# Altium schematic sheet Digital_DSP.SchDoc
size 508 x 241 mm
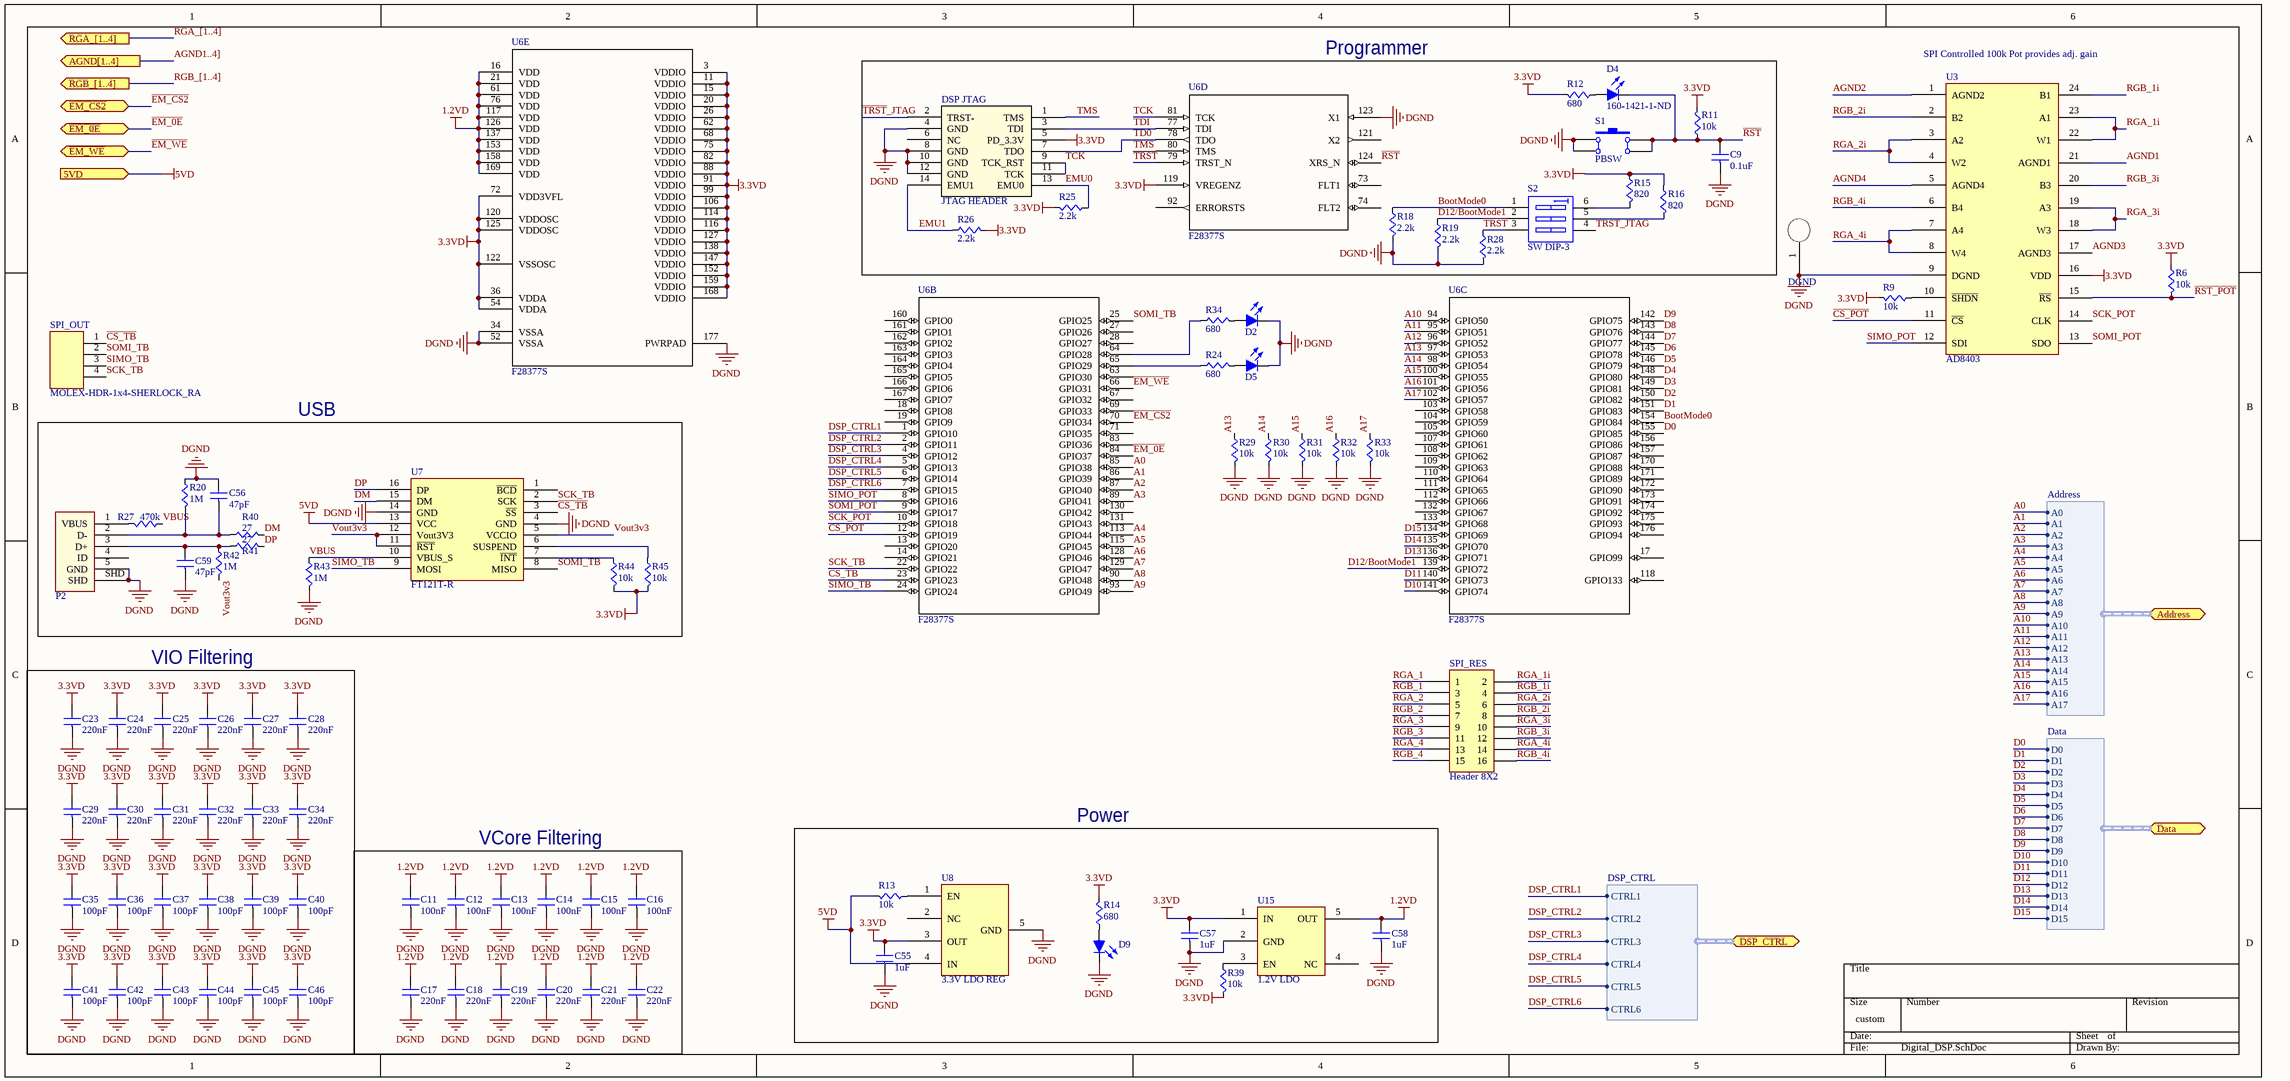
[diagram p0: Digital_DSP.SchDoc]

## Parts
C9  value 0.1uF  [CAPC0603]  (hidden comment: Cap)
C11  value 100nF  [CAPC0603]  (hidden comment: Cap)
C12  value 100nF  [CAPC0603]  (hidden comment: Cap)
C13  value 100nF  [CAPC0603]  (hidden comment: Cap)
C14  value 100nF  [CAPC0603]  (hidden comment: Cap)
C15  value 100nF  [CAPC0603]  (hidden comment: Cap)
C16  value 100nF  [CAPC0603]  (hidden comment: Cap)
C17  value 220nF  [CAPC0603]  (hidden comment: Cap)
C18  value 220nF  [CAPC0603]  (hidden comment: Cap)
C19  value 220nF  [CAPC0603]  (hidden comment: Cap)
C20  value 220nF  [CAPC0603]  (hidden comment: Cap)
C21  value 220nF  [CAPC0603]  (hidden comment: Cap)
C22  value 220nF  [CAPC0603]  (hidden comment: Cap)
C23  value 220nF  [CAPC0603]  (hidden comment: Cap)
C24  value 220nF  [CAPC0603]  (hidden comment: Cap)
C25  value 220nF  [CAPC0603]  (hidden comment: Cap)
C26  value 220nF  [CAPC0603]  (hidden comment: Cap)
C27  value 220nF  [CAPC0603]  (hidden comment: Cap)
C28  value 220nF  [CAPC0603]  (hidden comment: Cap)
C29  value 220nF  [CAPC0603]  (hidden comment: Cap)
C30  value 220nF  [CAPC0603]  (hidden comment: Cap)
C31  value 220nF  [CAPC0603]  (hidden comment: Cap)
C32  value 220nF  [CAPC0603]  (hidden comment: Cap)
C33  value 220nF  [CAPC0603]  (hidden comment: Cap)
C34  value 220nF  [CAPC0603]  (hidden comment: Cap)
C35  value 100pF  [CAPC0603]  (hidden comment: Cap)
C36  value 100pF  [CAPC0603]  (hidden comment: Cap)
C37  value 100pF  [CAPC0603]  (hidden comment: Cap)
C38  value 100pF  [CAPC0603]  (hidden comment: Cap)
C39  value 100pF  [CAPC0603]  (hidden comment: Cap)
C40  value 100pF  [CAPC0603]  (hidden comment: Cap)
C41  value 100pF  [CAPC0603]  (hidden comment: Cap)
C42  value 100pF  [CAPC0603]  (hidden comment: Cap)
C43  value 100pF  [CAPC0603]  (hidden comment: Cap)
C44  value 100pF  [CAPC0603]  (hidden comment: Cap)
C45  value 100pF  [CAPC0603]  (hidden comment: Cap)
C46  value 100pF  [CAPC0603]  (hidden comment: Cap)
C55  value 1uF  [CAPC0603]  (hidden comment: Cap1206)
C56  value 47pF  [CAPC0603]  (hidden comment: Cap1206)
C57  value 1uF  [CAPC0603]  (hidden comment: Cap1206)
C58  value 1uF  [CAPC0603]  (hidden comment: Cap1206)
C59  value 47pF  [CAPC0603]  (hidden comment: Cap1206)
D2  LED-RED  [LED0805-RED]  (value not drawn)
D4  Supplier Part Number: 160-1421-1-ND  [LED0805-RED]  (hidden comment: LED-RED)
D5  LED-RED  [LED0805-RED]  (value not drawn)
D9  LED-RED  [LED0805-RED]  (value not drawn)
DGND  Test_Point  [TP]  (value not drawn)
DSP_JTAG  JTAG HEADER  [JTAG HEADER - 14]
P2  USB Micro  [10118192-0001LF]  (value not drawn)
R6  value 10k  [RES0603]  (hidden comment: Res)
R9  value 10k  [RES0603]  (hidden comment: Res)
R11  value 10k  [RES0603]  (hidden comment: Res)
R12  value 680  [RES0603]  (hidden comment: Res)
R13  value 10k  [RES0603]  (hidden comment: Res)
R14  value 680  [RES0603]  (hidden comment: Res)
R15  value 820  [RES0603]  (hidden comment: Res)
R16  value 820  [RES0603]  (hidden comment: Res)
R18  value 2.2k  [RES0603]  (hidden comment: Res)
R19  value 2.2k  [RES0603]  (hidden comment: Res)
R20  value 1M  [RES0603]  (hidden comment: Res)
R24  value 680  [RES0603]  (hidden comment: Res)
R25  value 2.2k  [RES0603]  (hidden comment: Res)
R26  value 2.2k  [RES0603]  (hidden comment: Res)
R27  value 470k  [RES0603]  (hidden comment: Res)
R28  value 2.2k  [RES0603]  (hidden comment: Res)
R29  value 10k  [RES0603]  (hidden comment: Res)
R30  value 10k  [RES0603]  (hidden comment: Res)
R31  value 10k  [RES0603]  (hidden comment: Res)
R32  value 10k  [RES0603]  (hidden comment: Res)
R33  value 10k  [RES0603]  (hidden comment: Res)
R34  value 680  [RES0603]  (hidden comment: Res)
R39  value 10k  [RES0603]  (hidden comment: Res)
R40  value 27  [RES0603]  (hidden comment: Res)
R41  value 27  [RES0603]  (hidden comment: Res)
R42  value 1M  [RES0603]  (hidden comment: Res)
R43  value 1M  [RES0603]  (hidden comment: Res)
R44  value 10k  [RES0603]  (hidden comment: Res)
R45  value 10k  [RES0603]  (hidden comment: Res)
S1  PBSW  [PBSW]
S2  SW DIP-3  [DIP-6]
SPI_OUT  MOLEX-HDR-1x4-SHERLOCK_RA  [MOLEX-HDR-1X4-SHERLOCK-RA]
SPI_RES  Header 8X2  [HDR2X8]
U3  AD8403  [SOIC-24n]
U6  F28377S  [Tqfp-176]  (parts B,C,D,E of 5)
U7  FT121T-R  [TSSOP-16pin]
U8  3.3V LDO REG  [SOT223-8N]
U15  1.2V LDO  [sot23-5n]

## Blocks framed on the sheet
Programmer: C9 D4 DSP_JTAG R11 R12 R15 R16 R18 R19 R25 R26 R28 S1 S2 U6
USB: C56 C59 P2 R20 R27 R40-R45 U7
VIO Filtering: C23-C46
Power: C55 C57 C58 D9 R13 R14 R39 U8 U15
VCore Filtering: C11-C22

## Ports
5VD (in), Address (harness Address), AGND[1..4] (out), Data (harness Data), DSP_CTRL (harness DSP_CTRL), RGA_[1..4] (out), RGB_[1..4] (out), ~{EM_0E} (bidir), ~{EM_CS2} (bidir), ~{EM_WE} (bidir)

## Harnesses
DSP_CTRL: CTRL1, CTRL2, CTRL3, CTRL4, CTRL5, CTRL6
Address: A0, A1, A2, A3, A4, A5, A6, A7, A8, A9, A10, A11, A12, A13, A14, A15, A16, A17
Data: D0, D1, D2, D3, D4, D5, D6, D7, D8, D9, D10, D11, D12, D13, D14, D15

## Nets
1: S1.2(A')
1.2VD: C11.1(A) C12.1(A) C13.1(A) C14.1(A) C15.1(A) C16.1(A) C17.1(A) C18.1(A) C19.1(A) C20.1(A) C21.1(A) C22.1(A) C58.1(A) U6.16(VDD) U6.21(VDD) U6.61(VDD) U6.76(VDD) U6.117(VDD) U6.126(VDD) U6.137(VDD) U6.153(VDD) U6.158(VDD) U6.169(VDD) U15.5(OUT)
3: S1.4(B')
3.3VD: C23.1(A) C24.1(A) C25.1(A) C26.1(A) C27.1(A) C28.1(A) C29.1(A) C30.1(A) C31.1(A) C32.1(A) C33.1(A) C34.1(A) C35.1(A) C36.1(A) C37.1(A) C38.1(A) C39.1(A) C40.1(A) C41.1(A) C42.1(A) C43.1(A) C44.1(A) C45.1(A) C46.1(A) C55.1(A) C57.1(A) DSP_JTAG.5(PD_3.3V) R6.2(B) R9.1(A) R11.1(A) R12.1(A) R14.1(A) R15.2(B) R16.2(B) R25.1(A) R26.1(A) R39.1(A) R44.1(A) R45.1(A) U3.16(VDD) U6.3(VDDIO) U6.11(VDDIO) U6.15(VDDIO) U6.20(VDDIO) U6.26(VDDIO) U6.36(VDDA) U6.54(VDDA) U6.62(VDDIO) U6.68(VDDIO) U6.72(VDD3VFL) U6.75(VDDIO) U6.82(VDDIO) U6.88(VDDIO) U6.91(VDDIO) U6.99(VDDIO) U6.106(VDDIO) U6.114(VDDIO) U6.116(VDDIO) U6.119(VREGENZ) U6.120(VDDOSC) U6.122(VSSOSC) U6.125(VDDOSC) U6.127(VDDIO) U6.138(VDDIO) U6.147(VDDIO) U6.152(VDDIO) U6.159(VDDIO) U6.168(VDDIO) U8.3(OUT) U15.1(IN)
5VD: R13.1(A) U7.13(VCC) U8.4(IN) ; port 5VD
DGND: C9.2(B) C11.2(B) C12.2(B) C13.2(B) C14.2(B) C15.2(B) C16.2(B) C17.2(B) C18.2(B) C19.2(B) C20.2(B) C21.2(B) C22.2(B) C23.2(B) C24.2(B) C25.2(B) C26.2(B) C27.2(B) C28.2(B) C29.2(B) C30.2(B) C31.2(B) C32.2(B) C33.2(B) C34.2(B) C35.2(B) C36.2(B) C37.2(B) C38.2(B) C39.2(B) C40.2(B) C41.2(B) C42.2(B) C43.2(B) C44.2(B) C45.2(B) C46.2(B) C55.2(B) C56.1(A) C57.2(B) C58.2(B) C59.2(B) D2.1(K) D5.1(K) D9.1(K) DGND.1 DSP_JTAG.4(GND) DSP_JTAG.8(GND) DSP_JTAG.10(GND) DSP_JTAG.12(GND) P2.5(GND) P2.SHD R18.1(A) R19.1(A) R20.2(B) R28.1(A) R29.1(A) R30.1(A) R31.1(A) R32.1(A) R33.1(A) R43.1(A) S1.1(A) S1.2(A') U3.9(DGND) U6.34(VSSA) U6.52(VSSA) U6.123(X1) U6.177(PWRPAD) U7.4(GND) U7.14(GND) U8.5(GND) U15.2(GND)
A0: U6.85(GPIO38) ; port Address.A0
A1: U6.86(GPIO39) ; port Address.A1
A2: U6.87(GPIO40) ; port Address.A2
A3: U6.89(GPIO41) ; port Address.A3
A4: U6.113(GPIO44) ; port Address.A4
A5: U6.115(GPIO45) ; port Address.A5
A6: U6.128(GPIO46) ; port Address.A6
A7: U6.129(GPIO47) ; port Address.A7
A8: U6.90(GPIO48) ; port Address.A8
A9: U6.93(GPIO49) ; port Address.A9
A10: U6.94(GPIO50) ; port Address.A10
A11: U6.95(GPIO51) ; port Address.A11
A12: U6.96(GPIO52) ; port Address.A12
A13: R29.2(B) U6.97(GPIO53) ; port Address.A13
A14: R30.2(B) U6.98(GPIO54) ; port Address.A14
A15: R31.2(B) U6.100(GPIO55) ; port Address.A15
A16: R32.2(B) U6.101(GPIO56) ; port Address.A16
A17: R33.2(B) U6.102(GPIO57) ; port Address.A17
AGND1: U3.21(AGND1)
AGND2: U3.1(AGND2)
AGND3: U3.17(AGND3)
AGND4: U3.5(AGND4)
BootMode0: R18.2(B) S2.1(A1) U6.154(GPIO84)
~{CS_POT}: U3.11(~{CS}) U6.12(GPIO19)
~{CS_TB}: SPI_OUT.1 U6.23(GPIO23) U7.3(~{SS})
D0: U6.155(GPIO85) ; port Data.D0
D1: U6.151(GPIO83) ; port Data.D1
D2: U6.150(GPIO82) ; port Data.D2
D3: U6.149(GPIO81) ; port Data.D3
D4: U6.148(GPIO80) ; port Data.D4
D5: U6.146(GPIO79) ; port Data.D5
D6: U6.145(GPIO78) ; port Data.D6
D7: U6.144(GPIO77) ; port Data.D7
D8: U6.143(GPIO76) ; port Data.D8
D9: U6.142(GPIO75) ; port Data.D9
D10: U6.141(GPIO74) ; port Data.D10
D11: U6.140(GPIO73) ; port Data.D11
D12: port Data.D12
D12/BootMode1: R19.2(B) S2.2(A2) U6.139(GPIO72)
D13: U6.136(GPIO71) ; port Data.D13
D14: U6.135(GPIO70) ; port Data.D14
D15: U6.134(GPIO69) ; port Data.D15
DM: R40.1(A) U7.15(DM)
DP: R41.1(A) U7.16(DP)
DSP_CTRL1: U6.1(GPIO10) ; port DSP_CTRL.CTRL1
DSP_CTRL2: U6.2(GPIO11) ; port DSP_CTRL.CTRL2
DSP_CTRL3: U6.4(GPIO12) ; port DSP_CTRL.CTRL3
DSP_CTRL4: U6.5(GPIO13) ; port DSP_CTRL.CTRL4
DSP_CTRL5: U6.6(GPIO14) ; port DSP_CTRL.CTRL5
DSP_CTRL6: U6.7(GPIO15) ; port DSP_CTRL.CTRL6
~{EM_0E}: U6.84(GPIO37) ; port ~{EM_0E}
~{EM_CS2}: U6.70(GPIO34) ; port ~{EM_CS2}
~{EM_WE}: U6.66(GPIO31) ; port ~{EM_WE}
EMU0: DSP_JTAG.13(EMU0) R25.2(B)
EMU1: DSP_JTAG.14(EMU1) R26.2(B)
~{RST}: C9.1(A) D4.1(K) R11.2(B) S1.3(B) S1.4(B') U6.124(XRS_N)
~{RST_POT}: R6.1(A) U3.15(~{RS})
RGA_1: SPI_RES.1
RGA_1i: SPI_RES.2 U3.22(W1) U3.23(A1)
RGA_2: SPI_RES.5
RGA_2i: SPI_RES.6 U3.3(A2) U3.4(W2)
RGA_3: SPI_RES.9
RGA_3i: SPI_RES.10 U3.18(W3) U3.19(A3)
RGA_4: SPI_RES.13
RGA_4i: SPI_RES.14 U3.7(A4) U3.8(W4)
RGB_1: SPI_RES.3
RGB_1i: SPI_RES.4 U3.24(B1)
RGB_2: SPI_RES.7
RGB_2i: SPI_RES.8 U3.2(B2)
RGB_3: SPI_RES.11
RGB_3i: SPI_RES.12 U3.20(B3)
RGB_4: SPI_RES.15
RGB_4i: SPI_RES.16 U3.6(B4)
SCK_POT: U3.14(CLK) U6.10(GPIO18)
SCK_TB: SPI_OUT.4 U6.22(GPIO22) U7.2(SCK)
SIMO_POT: U3.12(SDI) U6.8(GPIO16)
SIMO_TB: SPI_OUT.3 U6.24(GPIO24) U7.9(MOSI)
SOMI_POT: U3.13(SDO) U6.9(GPIO17)
SOMI_TB: SPI_OUT.2 U6.25(GPIO25) U7.8(MISO)
~{TRST}: R28.2(B) S2.3(A3) U6.79(TRST_N)
~{TRST}_JTAG: DSP_JTAG.2(TRST-) S2.4(B3)
TCK: DSP_JTAG.9(TCK_RST) DSP_JTAG.11(TCK) U6.81(TCK)
TD0: DSP_JTAG.7(TDO) U6.78(TDO)
TDI: DSP_JTAG.3(TDI) U6.77(TDI)
TMS: DSP_JTAG.1(TMS) U6.80(TMS)
VBUS: R27.2(B) R43.2(B) U7.10(VBUS_S)
Vout3v3: R42.1(A) U7.5(VCCIO) U7.11(~{RST}) U7.12(Vout3V3)
NetC56_2: C56.2(B) P2.2(D-) R20.1(A) R40.2(B)
NetC59_1: C59.1(A) P2.3(D+) R41.2(B) R42.2(B)
NetD2_2: D2.2(A) R34.1(A)
NetD4_2: D4.2(A) R12.2(B)
NetD5_2: D5.2(A) R24.1(A)
NetD9_2: D9.2(A) R14.2(B)
NetP2_1: P2.1(VBUS) R27.1(A)
NetR9_2: R9.2(B) U3.10(~{SHDN})
NetR13_2: R13.2(B) U8.1(EN)
NetR15_1: R15.1(A) S2.6(B1)
NetR16_1: R16.1(A) S2.5(B2)
NetR24_2: R24.2(B) U6.65(GPIO29)
NetR34_2: R34.2(B) U6.64(GPIO28)
NetR39_2: R39.2(B) U15.3(EN)
NetR44_2: R44.2(B) U7.7(~{INT})
NetR45_2: R45.2(B) U7.6(SUSPEND)

Not connected (* = marked no-connect by the designer): DSP_JTAG 6(NC); P2 4(ID); U6 13(GPIO20) 14(GPIO21) 17(GPIO99) 18(GPIO8) 19(GPIO9) 27(GPIO26) 28(GPIO27) 63(GPIO30) 67(GPIO32) 69(GPIO33) 71(GPIO35) 73(FLT1) 74(FLT2) 83(GPIO36) 92(ERRORSTS) 103(GPIO58) 104(GPIO59) 105(GPIO60) 107(GPIO61) 108(GPIO62) 109(GPIO63) 110(GPIO64) 111(GPIO65) 112(GPIO66) 118(GPIO133) 121(X2) 130(GPIO42) 131(GPIO43) 132(GPIO67) 133(GPIO68) 156(GPIO86) 157(GPIO87) 160(GPIO0) 161(GPIO1) 162(GPIO2) 163(GPIO3) 164(GPIO4) 165(GPIO5) 166(GPIO6) 167(GPIO7) 170(GPIO88) 171(GPIO89) 172(GPIO90) 173(GPIO91) 174(GPIO92) 175(GPIO93) 176(GPIO94); U7 1(~{BCD}); U8 2(NC); U15 4(NC)

## Buses and harness runs
bus AGND1..4] = port AGND[1..4]
bus RGA_[1..4] = port RGA_[1..4]
bus RGB_[1..4] = port RGB_[1..4]

## Notes on the sheet
- (near U3) SPI Controlled 100k Pot provides adj. gain

## Library data of the parts
C55-C59 = Cap1206: CAP CER 1UF 50V 10% X7R 1206; Supplier 1: Digi-Key; Supplier Part Number 1: 587-2230-1-ND
D2 D4 D5 D9 = LED-RED: Light Emitting Diode - RED; Manufacturer Part Number: LTST-C171CKT; Manufacturer: Lite-On Inc; Voltage - Forward (Vf) Typ: 1.8V; Current - Test: 20mA; Millicandela Rating: 25mcd; Viewing Angle: 130°; Color: Red; Supplier: Digi-Key; Package / Case: 0805 (2012 Metric)
  D2 D5 D9: Supplier Part Number: 160-1421-1-ND
DGND = Test_Point: TEST POINT PC COMPACT .063"D; Supplier 1: Digi-Key; Supplier Part Number 1: 5006K-ND
DSP_JTAG = JTAG-TI_14: 14 Pin JTAG Header
P2 = USB Micro: USB Mini B Metal Shield SMT; Supplier 1: Digi-Key; Supplier Part Number 1: 609-4613-1-ND
S1 = SW-PB: Push Button Switch; Manufacturer: Panasonic Electronic Components; Manufacturer Part Number: EVQ-9P105M; Outline: 6.10mm x 6.00mm; Actuator Orientation: Top Actuated; Actuator Height off PCB, from Pins: 5.00mm; Published: 24-Mar-1999; LatestRevisionDate: 17-Jul-2002; LatestRevisionNote: Re-released for DXP Platform.; PackageReference: SPST-2; Publisher: Altium Limited; PackageDescription: Switch; 2 Leads; Supplier: Digi-Key; Supplier Part Number: P13586SCT-ND
S2 = SW DIP-3: DIP Switch, 3 Position, SPST; Published: 24-Mar-1999; LatestRevisionDate: 17-Jul-2002; LatestRevisionNote: Re-released for DXP Platform.; PackageReference: DIP-6; Publisher: Altium Limited; Code_JEDEC: MO-001-AM
SPI_OUT = MOLEX-HDR-1x4-SHERLOCK_RA: Header, Molex, 2mm Pitch Sherlock Header, Single Row, Horizontal, 4 Circuits, Length 3.3mm; Manufacturer Part Number: 0353630460; Supplier Part Number 1: WM18933-ND; Manufacturer: Molex; Supplier 1: Digikey
SPI_RES = Header 8X2: Header, 8-Pin, Dual row; LatestRevisionDate: 17-Jul-2002; LatestRevisionNote: Re-released for DXP Platform.; Publisher: Altium Limited
U3 = AD8403: IC POT DGTL 8BIT 100K 4CH 24SOIC; Supplier 1: Digi-Key; Supplier Part Number 1: AD8403ARZ100-ND
U6 = TMS320F28377SPTP: IC MCU 32BIT 1024KB 176LQFP; Manufacturer: Texas Instruments; PIN_COUNT: 177; PartNumber: TMS320F28377SPTP; PackageReference: PTP0176F; MountType: SMT; CompType: IC; RoHS: Y; RefDes: RefDes; Type: DEV; Value: Value; Supplier Part Number 1: 296-39643-ND; Supplier 1: Digi-Key
U7 = FT121T-R: IC USB CONTROLLER SPI 16-TSSOP; Supplier 1: Digi-Key; Supplier Part Number 1: 768-1167-1-ND
U8 = LP38691: IC REG LDO 3.3V 0.5A SOT223-5; Supplier 1: Digi-Key; Supplier Part Number 1: LP38693MP-3.3/NOPBCT-ND
U15 = LP3990MF-1.2: IC REG LDO 1.2V 0.15A SOT23-5; Supplier 1: Digi-Key; Supplier Part Number 1: LP3990MF-1.2/NOPBCT-ND
C9 C11-C46 = Cap: Supplier 1: Digi-Key; Supplier Part Number 1: 1276-1000-1-ND
R6 R9 R11-R16 R18-R20 R24-R34 R39-R45 = Res: Supplier 1: Digi-Key; Supplier Part Number 1: RMCF0603JT10K0CT-ND